# Altium project PulseConditioner.PrjPcb
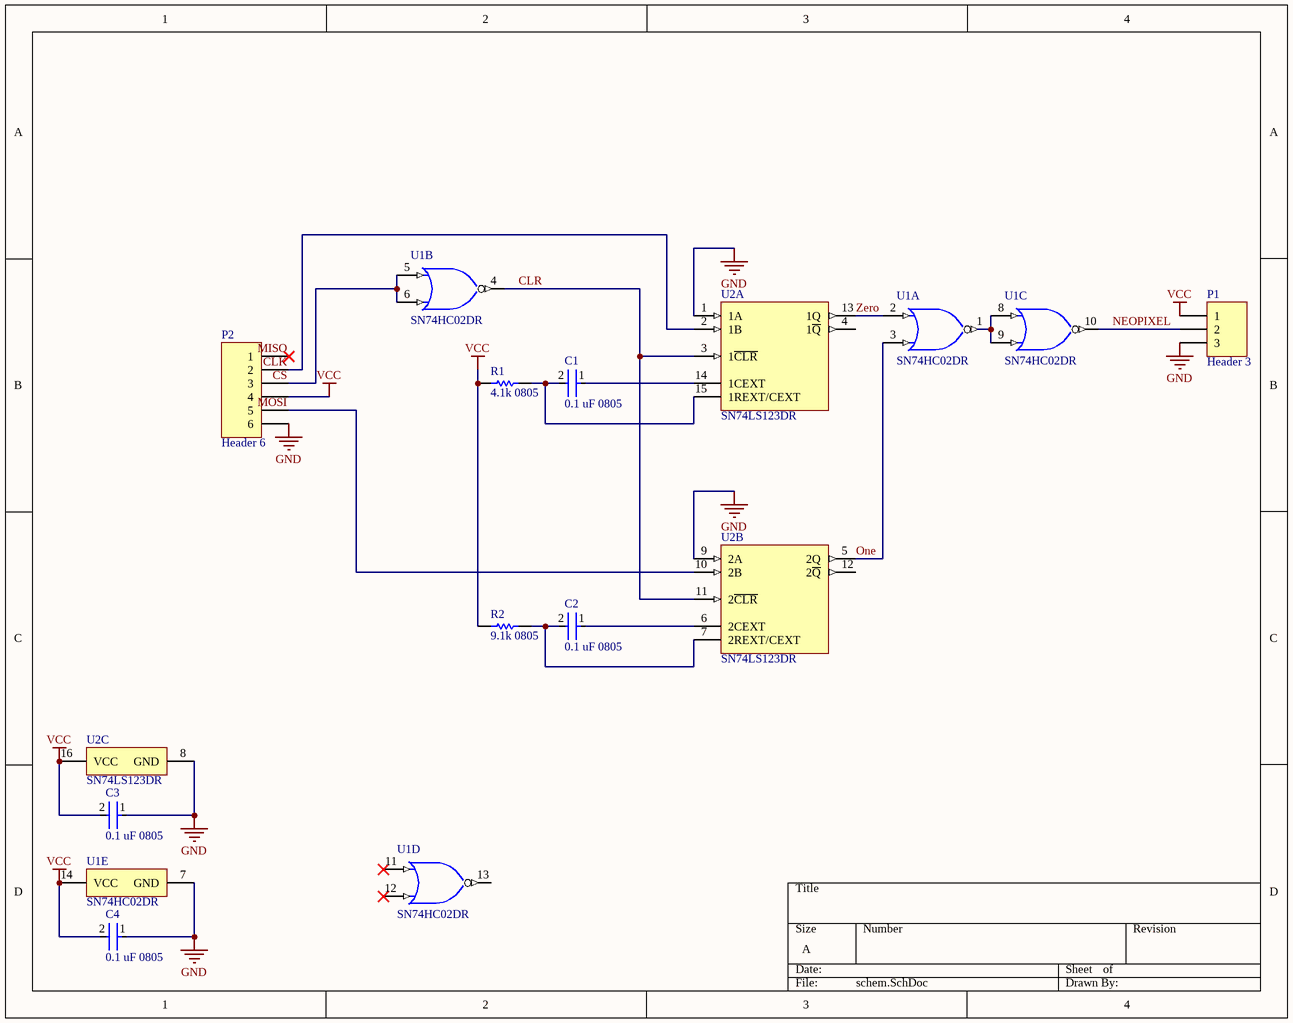
[diagram p0: schem.SchDoc]
1 sheet, 10 parts. Net scope: global (net labels, ports and power ports of the same name join across sheets).
Board file: PCB3.PcbDoc

## Sheet schem.SchDoc
size A

### Parts
C1  0.1 uF 0805  [FP-C0805C-DN-MFG]
C2  0.1 uF 0805  [FP-C0805C-DN-MFG]
C3  0.1 uF 0805  [FP-C0805C-DN-MFG]
C4  0.1 uF 0805  [FP-C0805C-DN-MFG]
P1  Header 3  [HDR1X3]
P2  Header 6  [HDR1X6]
R1  4.1k 0805  [RESC2013X50X30LL20T20]
R2  9.1k 0805  [RESC2013X50X30LL20T20]
U1  SN74HC02DR  [D0014A_L]  (parts A,B,C,D,E of 5)
U2  SN74LS123DR  [D0016A_L]  (parts A,B,C of 3)

### Nets
GND: C3.1 C4.1 P1.3 P2.6 U1.7(GND) U2.1(1A) U2.8(GND) U2.9(2A)
VCC: C3.2 C4.2 P1.1 P2.4 R1.1 R2.1 U1.14(VCC) U2.16(VCC)
CLK: P2.2 U2.2(1B)
CLR: U1.4(2Y) U2.3(1~{CLR}) U2.11(2~{CLR})
CS: P2.3 U1.5(2A) U1.6(2B)
MISO: P2.1
MOSI: P2.5 U2.10(2B)
NEOPIXEL: P1.2 U1.10(3Y)
One: U1.3(1B) U2.5(2Q)
Zero: U1.2(1A) U2.13(1Q)
NetC1_1: C1.1 U2.14(1CEXT)
NetC1_2: C1.2 R1.2 U2.15(1REXT/CEXT)
NetC2_1: C2.1 U2.6(2CEXT)
NetC2_2: C2.2 R2.2 U2.7(2REXT/CEXT)
NetU1_1: U1.1(1Y) U1.8(3A) U1.9(3B)

Not connected (* = marked no-connect by the designer): U1 11(4A)* 12(4B)* 13(4Y); U2 4(1~{Q}) 12(2~{Q})

### Library data of the parts
C1-C4 = CMP-03020-032818-1: CAP CER 0.1UF 100V X7R 0805; Manufacturer: KEMET; Manufacturer Part Number: C0805C104K1RACAUTO; Temperature Coefficient: 30ppm/°C; Capacitance: 0.10 μF; Material: Ceramic; Tolerance: 0.1; Value: 0.10 μF; Category: Cap; Temperature: -55°C to +125°C; ComponentLink2Description: Datasheet; Temperature Range Low: -55°C; Device Class L2: Capacitors; ComponentLink2URL: https://content.kemet.com/datasheets/KEM_C1003_C0G_SMD.pdf; Ipc Land Pattern Name: CAPC200125X78; Temperature Range High: +125°C; Package: C0805C-DN; Temperature Characteristic: X7R; Height: 0.88mm; Digikey Description: CAP CER 0.1UF 100V X7R 0805; Voltage Rating: 100 V; Device Class L3: Ceramic Capacitors; Device Class L1: Passive Components; Lead Free: Yes; RoHS: TRUE; Automotive: No; Octopart: https://octopart.com/c0805c104k1racauto-kemet-12625098
P1 = Header 3: Header, 3-Pin; LatestRevisionDate: 17-Jul-2002; LatestRevisionNote: Re-released for DXP Platform.; Publisher: Altium Limited
P2 = Header 6: Header, 6-Pin; LatestRevisionDate: 17-Jul-2002; LatestRevisionNote: Re-released for DXP Platform.; Publisher: Altium Limited
R1 R2 = CMP-2001-04896-1: Manufacturer: Vishay Dale; Part Number: CRCW08050000Z0EA
U1 = CMP-0806-00065-3: Quadruple 2-Input Positive-NOR Gates, D0014A, LARGE T&R; Manufacturer: Texas Instruments; Output Type: CMOS; Rating: Catalog; Voltage(Nom)(V): 5; VCC(Max)(V): 6; VCC(Min)(V): 2; ICC @ Nom Voltage(Max)(mA): 0.02; F @ Nom Voltage(Max)(Mhz): 70; Output Drive (IOL/IOH)(Max)(mA): 4/-4; tpd @ Nom Voltage(Max)(ns): 23; Bits(#): 4; PackageReference: D0014A; DatasheetVersion: SCLS076E; Code_JEDEC: MS-012; Input Type: CMOS; PackageVersion: http://www.ti.com/lit/ml/mpds177g/mpds177g.pdf; Operating Temperature Range(C): -40 to 85; Generic Part Number: SN74HC02
U2 = CMP-1629-00043-2: Dual retriggerable monostable multivibrators, D0016A, LARGE T&R; Manufacturer: Texas Instruments; Technology Family: LS; Rating: Catalog; Voltage(Nom)(V): 5; Schmitt Trigger: No; ICC @ Nom Voltage(Max)(mA): 20; Output Type: TTL; F @ Nom Voltage(Max)(Mhz): 35; Bits(#): 2; Output Drive (IOL/IOH)(Max)(mA): 8/-0.4; VCC(Min)(V): 4.75; tpd @ Nom Voltage(Max)(ns): 56; VCC(Max)(V): 5.25; Generic Part Number: SN74LS123; DatasheetVersion: SDLS043; PackageReference: D0016A; Operating Temperature Range(C): 0 to 70; Input Type: TTL; Code_JEDEC: MS-012 variation AC